# Altium schematic sheet 16Ch_Milti_INA219.SchDoc
size A4; SheetNumber: 1; SheetTotal: 2
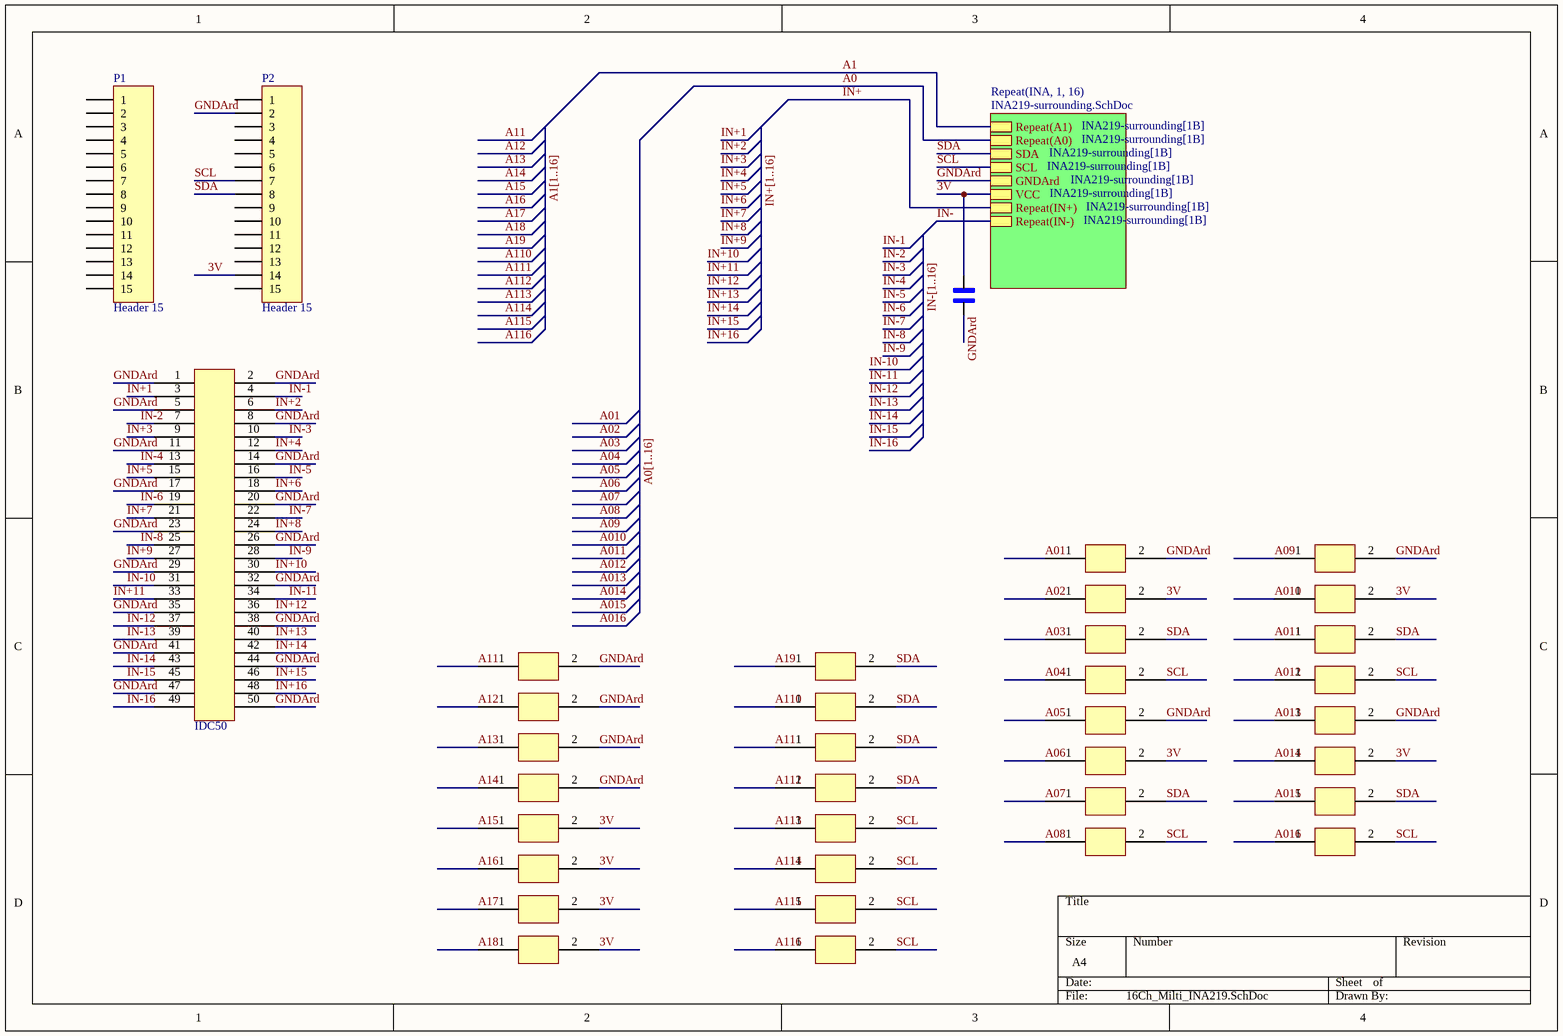
[diagram p0: 16Ch_Milti_INA219.SchDoc]

## Parts
*1  IDC50  [IDC50]
P1  Header 15  [HDR1X15]
P2  Header 15  [HDR1X15]
R1  RES0603  [RES0603]  (value not drawn)
R2  RES0603  [RES0603]  (value not drawn)
R3  RES0603  [RES0603]  (value not drawn)
R4  RES0603  [RES0603]  (value not drawn)
R5  RES0603  [RES0603]  (value not drawn)
R6  RES0603  [RES0603]  (value not drawn)
R7  RES0603  [RES0603]  (value not drawn)
R8  RES0603  [RES0603]  (value not drawn)
R9  RES0603  [RES0603]  (value not drawn)
R10  RES0603  [RES0603]  (value not drawn)
R11  RES0603  [RES0603]  (value not drawn)
R12  RES0603  [RES0603]  (value not drawn)
R13  RES0603  [RES0603]  (value not drawn)
R14  RES0603  [RES0603]  (value not drawn)
R15  RES0603  [RES0603]  (value not drawn)
R16  RES0603  [RES0603]  (value not drawn)
R17  RES0603  [RES0603]  (value not drawn)
R18  RES0603  [RES0603]  (value not drawn)
R19  RES0603  [RES0603]  (value not drawn)
R20  RES0603  [RES0603]  (value not drawn)
R21  RES0603  [RES0603]  (value not drawn)
R22  RES0603  [RES0603]  (value not drawn)
R23  RES0603  [RES0603]  (value not drawn)
R24  RES0603  [RES0603]  (value not drawn)
R25  RES0603  [RES0603]  (value not drawn)
R26  RES0603  [RES0603]  (value not drawn)
R27  RES0603  [RES0603]  (value not drawn)
R28  RES0603  [RES0603]  (value not drawn)
R29  RES0603  [RES0603]  (value not drawn)
R30  RES0603  [RES0603]  (value not drawn)
R31  RES0603  [RES0603]  (value not drawn)
R32  RES0603  [RES0603]  (value not drawn)
С1  CAP0805  [CAP0805]  (value not drawn)

## Sub-sheets
Repeat(INA, 1, 16) = INA219-surrounding.SchDoc: Repeat(A1), Repeat(A0), SDA, SCL, GNDArd, VCC, Repeat(IN+), Repeat(IN-)

## Nets
3V: P2.14 R5.2 R6.2 R7.2 R8.2 R18.2 R22.2 R26.2 R30.2 С1.2 ; sheet Repeat(INA, 1, 16)/VCC
A0: sheet Repeat(INA, 1, 16)/Repeat(A0)
A01: R17.1
A1: sheet Repeat(INA, 1, 16)/Repeat(A1)
A02: R18.1
A03: R19.1
A04: R20.1
A05: R21.1
A06: R22.1
A07: R23.1
A08: R24.1
A09: R25.1
A010: R26.1
A11: R1.1
A011: R27.1
A12: R2.1
A012: R28.1
A13: R3.1
A013: R29.1
A14: R4.1
A014: R30.1
A15: R5.1
A015: R31.1
A16: R6.1
A016: R32.1
A17: R7.1
A18: R8.1
A19: R9.1
A110: R10.1
A111: R11.1
A112: R12.1
A113: R13.1
A114: R14.1
A115: R15.1
A116: R16.1
GNDArd: *1.1 *1.2 *1.5 *1.8 *1.11 *1.14 *1.17 *1.20 *1.23 *1.26 *1.29 *1.32 *1.35 *1.38 *1.41 *1.44 *1.47 *1.50 P2.2 R1.2 R2.2 R3.2 R4.2 R17.2 R21.2 R25.2 R29.2 С1.1 ; sheet Repeat(INA, 1, 16)/GNDArd
IN+: sheet Repeat(INA, 1, 16)/Repeat(IN+)
IN+1: *1.3
IN+2: *1.6
IN+3: *1.9
IN+4: *1.12
IN+5: *1.15
IN+6: *1.18
IN+7: *1.21
IN+8: *1.24
IN+9: *1.27
IN+10: *1.30
IN+11: *1.33
IN+12: *1.36
IN+13: *1.40
IN+14: *1.42
IN+15: *1.46
IN+16: *1.48
IN-: sheet Repeat(INA, 1, 16)/Repeat(IN-)
IN-1: *1.4
IN-2: *1.7
IN-3: *1.10
IN-4: *1.13
IN-5: *1.16
IN-6: *1.19
IN-7: *1.22
IN-8: *1.25
IN-9: *1.28
IN-10: *1.31
IN-11: *1.34
IN-12: *1.37
IN-13: *1.39
IN-14: *1.43
IN-15: *1.45
IN-16: *1.49
SCL: P2.7 R13.2 R14.2 R15.2 R16.2 R20.2 R24.2 R28.2 R32.2 ; sheet Repeat(INA, 1, 16)/SCL
SDA: P2.8 R9.2 R10.2 R11.2 R12.2 R19.2 R23.2 R27.2 R31.2 ; sheet Repeat(INA, 1, 16)/SDA

Not connected (* = marked no-connect by the designer): P1 1 2 3 4 5 6 7 8 9 10 11 12 13 14 15; P2 1 3 4 5 6 9 10 11 12 13 15

## Buses and harness runs
bus A0[1..16]
bus A1[1..16]
bus IN+[1..16]
bus IN-[1..16]

## Library data of the parts
P1 P2 = Header 15: Header, 15-Pin; LatestRevisionDate: 17-Jul-2002; LatestRevisionNote: Re-released for DXP Platform.; Publisher: Altium Limited